# EAGLE design Schematics (EAGLE 6.0)
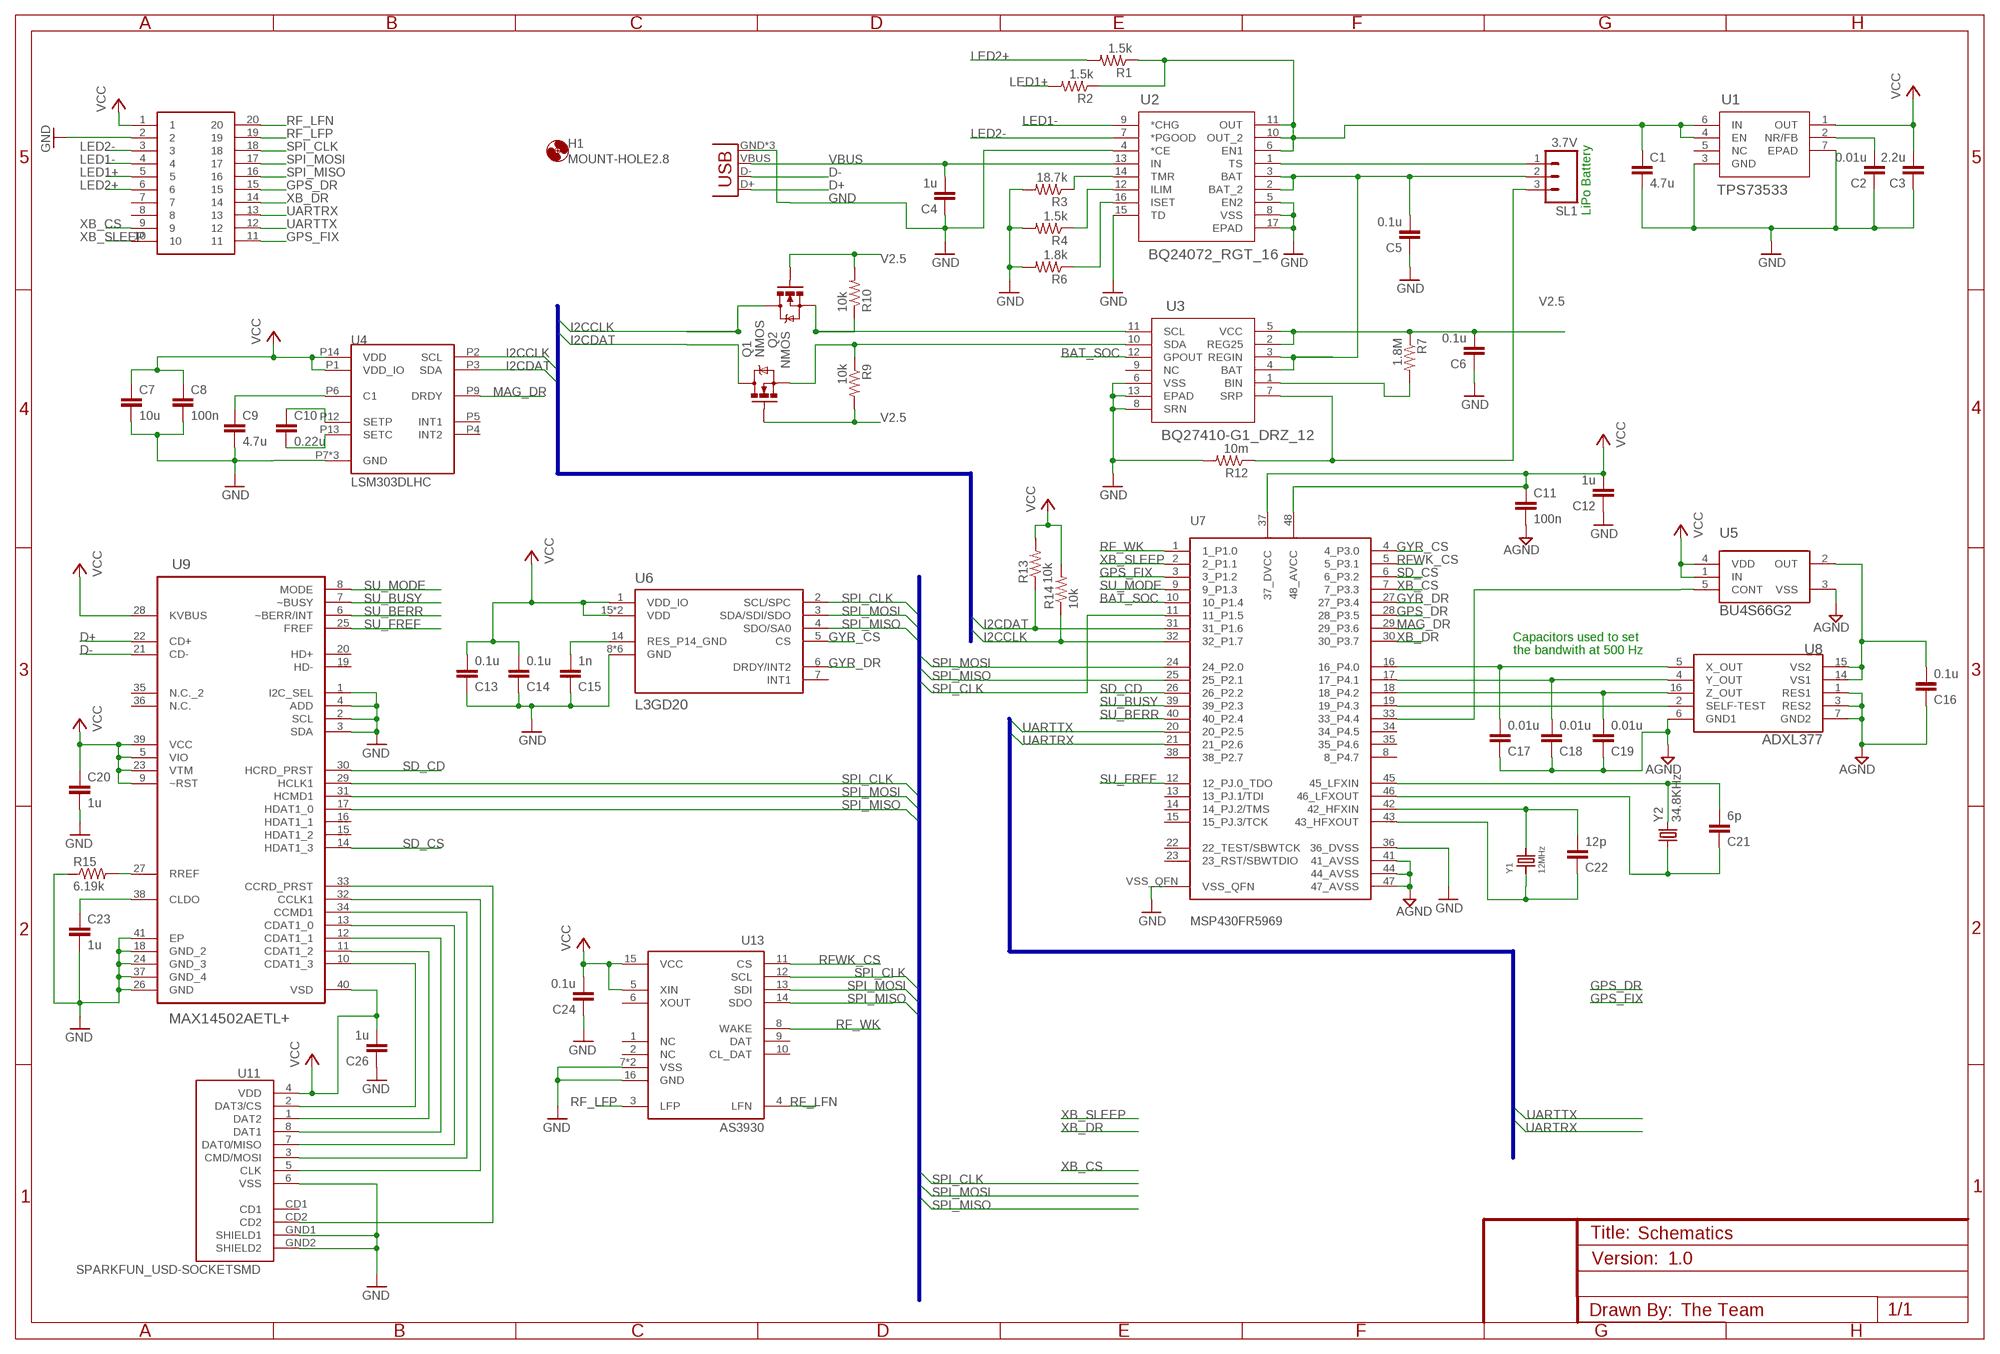
[diagram p0: schematic, sheet 1]

## Parts
C1  4.7u  C-EUC0603  [C0603]
C2  0.01u  C-EUC0603  [C0603]
C3  2.2u  C-EUC0603  [C0603]
C4  1u  C-EUC0603  [C0603]
C5  0.1u  C-EUC0603  [C0603]
C6  0.1u  C-EUC0603  [C0603]
C7  10u  C-EUC0603  [C0603]
C8  100n  C-EUC0603  [C0603]
C9  4.7u  C-EUC0603  [C0603]
C10  0.22u  C-EUC0603  [C0603]
C11  100n  C-EUC0603  [C0603]
C12  1u  C-EUC0603  [C0603]
C13  0.1u  C-EUC0603  [C0603]
C14  0.1u  C-EUC0603  [C0603]
C15  1n  C-EUC0603  [C0603]
C16  0.1u  C-EUC0603  [C0603]
C17  0.01u  C-EUC0603  [C0603]
C18  0.01u  C-EUC0603  [C0603]
C19  0.01u  C-EUC0603  [C0603]
C20  1u  C-EUC0603  [C0603]
C21  6p  C-EUC0603  [C0603]
C22  12p  C-EUC0603  [C0603]
C23  1u  C-EUC0603  [C0603]
C24  0.1u  C-EUC0603  [C0603]
C26  1u  C-EUC0603  [C0603]
H1  MOUNT-HOLE2.8  [2,8]
JP1  USB-MICROB  [USB-MICROB]
Q1  NMOS  MOSFET-NCHANNELBSS138  [SOT23]
Q2  NMOS  MOSFET-NCHANNELBSS138  [SOT23]
R1  1.5k  R-US_R0603  [R0603]
R2  1.5k  R-US_R0603  [R0603]
R3  18.7k  R-US_R0603  [R0603]
R4  1.5k  R-US_R0603  [R0603]
R6  1.8k  R-US_R0603  [R0603]
R7  1.8M  R-US_R0603  [R0603]
R9  10k  R-US_R0603  [R0603]
R10  10k  R-US_R0603  [R0603]
R12  10m  R-US_R0603  [R0603]
R13  10k  R-US_R0603  [R0603]
R14  10k  R-US_R0603  [R0603]
R15  6.19k  R-US_R0603  [R0603]
SL1  3.7V  M03  [03P]
U1  TPS73533  TPS73533_DRV_6  [DRV6_1P6X1]
U2  BQ24072_RGT_16  [RGT16_1P7X1P7]
U3  BQ27410-G1_DRZ_12  [DRZ12_1P95X2P45]
U4  LSM303DLHC  [LGA_3X5X1_14L]
U5  BU4S66G2  [SSOP5]
U6  L3GD20  [L3GD20]
U7  MSP430FR5969  [RGZ(S-PQFP-N48)]
U8  ADXL377  [LFCSP-16]
U9  MAX14502AETL+  [QFN40P500X500X80-41N]
U11  SPARKFUN_USD-SOCKETSMD  [SPARKFUN_MICRO-SD-SOCKET-PP]
U13  AS3930  [AS3930]
U$1  20-SOCKET  [20-SOCKET]
Y1  12MHz  CRYSTAL  [3.2X2.5MM]
Y2  34.8KHz  CRYSTALTC38H  [TC38H]

## Nets
AGND: C11.2 C16.1 C17.1 C18.1 C19.1 U5.3(VSS) U7.41(41_AVSS) U7.44(44_AVSS) U7.47(47_AVSS) U8.1(RES1) U8.3(RES2) U8.6(GND1) U8.7(GND2)
BAT_SOC: U3.12(GPOUT) U7.10(10_P1.4)
D+: JP1.D+ U9.22(CD+)
D-: JP1.D- U9.21(CD-)
GND: C1.2 C2.1 C3.1 C4.1 C5.1 C6.1 C7.2 C8.2 C9.2 C12.1 C13.1 C14.1 C15.1 C20.2 C23.2 C24.1 C26.1 JP1.GND JP1.MT1(GND) JP1.MT2(GND) R3.2 R4.2 R6.2 R12.2 R15.1 U1.3(GND) U1.7(EPAD) U2.4(*CE) U2.5(EN2) U2.8(VSS) U2.15(TD) U2.17(EPAD) U3.6(VSS) U3.8(SRN) U3.13(EPAD) U4.P7(GND) U4.P10(GND) U4.P11(GND) U6.8(GND) U6.9(GND) U6.10(GND) U6.11(GND) U6.12(GND) U6.13(GND) U7.36(36_DVSS) U7.VSS_QFN U9.1(I2C_SEL) U9.2(SCL) U9.3(SDA) U9.4(ADD) U9.18(GND_2) U9.24(GND_3) U9.26(GND) U9.37(GND_4) U9.41(EP) U11.6(VSS) U11.GND1(SHIELD1) U11.GND2(SHIELD2) U13.7(VSS) U13.16(GND) U13.EXP(VSS) U$1.2
GPS_DR: U7.28(28_P3.5) U$1.15
GPS_FIX: U7.3(3_P1.2) U$1.11
GYR_CS: U6.5(CS) U7.4(4_P3.0)
GYR_DR: U6.6(DRDY/INT2) U7.27(27_P3.4)
I2CCLK: Q2.3(D) R14.1 U4.P2(SCL) U7.32(32_P1.7)
I2CDAT: Q1.3(D) R13.1 U4.P3(SDA) U7.31(31_P1.6)
LED1+: R2.2 U$1.5
LED1-: U2.9(*CHG) U$1.4
LED2+: R1.2 U$1.6
LED2-: U2.7(*PGOOD) U$1.3
MAG_DR: U4.P9(DRDY) U7.29(29_P3.6)
N$1: U5.5(CONT) U7.33(33_P4.4)
N$2: C16.2 U5.2(OUT) U8.14(VS1) U8.15(VS2)
N$3: C21.2 U7.45(45_LFXIN) Y2.2
N$4: C21.1 U7.46(46_LFXOUT) Y2.1
N$5: U7.19(19_P4.3) U8.2(SELF-TEST)
N$6: Q1.2(S) R9.1 U3.10(SDA)
N$8: C15.2 U6.14(RES_P14_GND)
N$12: C22.2 U7.42(42_HFXIN) Y1.P$3
N$13: C1.1 R1.1 R2.1 U1.4(EN) U1.6(IN) U2.6(EN1) U2.10(OUT_2) U2.11(OUT)
N$15: C22.1 U7.43(43_HFXOUT) Y1.P$1
N$16: U9.10(CDAT1_3) U11.2(DAT3/CS)
N$17: U9.11(CDAT1_2) U11.1(DAT2)
N$18: C17.2 U7.16(16_P4.0) U8.5(X_OUT)
N$19: U9.12(CDAT1_1) U11.8(DAT1)
N$20: C18.2 U7.17(17_P4.1) U8.4(Y_OUT)
N$21: C19.2 U7.18(18_P4.2) U8.16(Z_OUT)
N$22: R7.2 U3.1(BIN)
N$23: U9.13(CDAT1_0) U11.7(DAT0/MISO)
N$24: Q2.2(S) R10.1 U3.11(SCL)
N$25: C9.1 U4.P6(C1)
N$26: C10.1 U4.P12(SETP)
N$27: C10.2 U4.P13(SETC)
N$28: R6.1 U2.16(ISET)
N$29: R4.1 U2.12(ILIM)
N$30: R3.1 U2.14(TMR)
N$31: C2.2 U1.2(NR/FB)
N$32: U9.34(CCMD1) U11.3(CMD/MOSI)
N$33: R12.1 SL1.3 U3.7(SRP)
N$37: U9.32(CCLK1) U11.5(CLK)
N$39: C5.2 SL1.2 U2.2(BAT_2) U2.3(BAT) U3.3(REGIN) U3.4(BAT)
N$40: SL1.1 U2.1(TS)
N$43: U9.33(CCRD_PRST) U11.CD2
N$46: R15.2 U9.27(RREF)
N$48: C23.1 U9.38(CLDO)
RF_LFN: U13.4(LFN) U$1.20
RF_LFP: U13.3(LFP) U$1.19
RF_WK: U7.1(1_P1.0) U13.8(WAKE)
RFWK_CS: U7.5(5_P3.1) U13.11(CS)
SD_CD: U7.26(26_P2.2) U9.30(HCRD_PRST)
SD_CS: U7.6(6_P3.2) U9.14(HDAT1_3)
SPI_CLK: U6.2(SCL/SPC) U7.11(11_P1.5) U9.29(HCLK1) U13.12(SCL) U$1.18
SPI_MISO: U6.4(SDO/SA0) U7.25(25_P2.1) U9.17(HDAT1_0) U13.14(SDO) U$1.16
SPI_MOSI: U6.3(SDA/SDI/SDO) U7.24(24_P2.0) U9.31(HCMD1) U13.13(SDI) U$1.17
SU_BERR: U7.40(40_P2.4) U9.6(~BERR/INT)
SU_BUSY: U7.39(39_P2.3) U9.7(~BUSY)
SU_FREF: U7.12(12_PJ.0_TDO) U9.25(FREF)
SU_MODE: U7.9(9_P1.3) U9.8(MODE)
UARTRX: U7.21(21_P2.6) U$1.13
UARTTX: U7.20(20_P2.5) U$1.12
V2.5: C6.2 Q1.1(G) Q2.1(G) R7.1 R9.2 R10.2 U3.2(REG25) U3.5(VCC)
VBUS: C4.2 JP1.VBUS U2.13(IN)
VCC: C3.2 C7.1 C8.1 C11.1 C12.2 C13.2 C14.2 C20.1 C24.2 C26.2 R13.2 R14.2 U1.1(OUT) U4.P1(VDD_IO) U4.P14(VDD) U5.1(IN) U5.4(VDD) U6.1(VDD_IO) U6.15(VDD) U6.16(VDD) U7.37(37_DVCC) U7.48(48_AVCC) U9.5(VIO) U9.9(~RST) U9.23(VTM) U9.28(KVBUS) U9.39(VCC) U9.40(VSD) U11.4(VDD) U13.5(XIN) U13.15(VCC) U$1.1
XB_CS: U7.7(7_P3.3) U$1.9
XB_DR: U7.30(30_P3.7) U$1.14
XB_SLEEP: U7.2(2_P1.1) U$1.10
Unconnected: U1.5(NC) U3.9(NC) U4.P4(INT2) U4.P5(INT1) U6.7(INT1) U7.8(8_P4.7) U7.13(13_PJ.1/TDI) U7.14(14_PJ.2/TMS) U7.15(15_PJ.3/TCK) U7.22(22_TEST/SBWTCK) U7.23(23_RST/SBWTDIO) U7.34(34_P4.5) U7.35(35_P4.6) U7.38(38_P2.7) U9.15(HDAT1_2) U9.16(HDAT1_1) U9.19(HD-) U9.20(HD+) U9.35(N.C._2) U9.36(N.C.) U11.CD1 U13.1(NC) U13.2(NC) U13.6(XOUT) U13.9(DAT) U13.10(CL_DAT) U$1.7 U$1.8

## Buses
I2CDAT,I2CCLK
SPI_CLK,SPI_MOSI,SPI_MISO
UARTTX,UARTRX

## Notes on the sheet
- LiPo Battery
- Capacitors used to set
- the bandwith at 500 Hz

## Library data of the parts
C1-C24 C26 = rcl:C-EU: CAPACITOR, European symbol
H1 = holes:MOUNT-HOLE: MOUNTING HOLE with drill center marker
JP1 = SparkFun-Connectors:USB: USB Connectors USB-B-PTH is fully proven SKU : PRT-00139/CONN-08278 USB-miniB is fully proven SKU : PRT-00587 USB-A-PCB is untested. USB-A-H is throughly reviewed, but untested. Spark Fun Electronics SKU : PRT-00437 USB-B-SMT is throughly reviewed, but untested. Needs silkscreen touching up. USB-A-S has not been used/tested USB-MB-H has not been used/tested USB-MICROB has been used. CONN-09505; PROD_ID: CONN-09505
Q1 Q2 = SparkFun-DiscreteSemi:MOSFET-NCHANNEL: Common NMOSFET Parts MFG P/N Store ID Prod ID FDD8780 TRANS-09984 SI7820DN TRANS-11055 FDS6630A IC-08089 2N7002PW TRANS-11151 FQP30N06L COM-10213 TRANS-10060 BSS123LT1G TRANS-08345 BSS138 TRANS-00830 BS170 2N7000; PROD_ID: TRANS-00830
R1-R4 R6 R7 R9 R10 R12-R15 = rcl:R-US_: RESISTOR, American symbol
SL1 = con-amp-quick:M03: AMP QUICK CONNECTOR; OC_FARNELL: unknown; OC_NEWARK: unknown
U1 = Micro2:TPS73533_DRV_6; DATASHEETURL: http://www.ti.com/lit/gpn/TPS73533; DESCRIPTION: Single Output LDO, 500mA, Fixed (3.3V), Low Quiescent Current, Low Noise, High PSRR; FAMILY_NAME: SINGLE CHANNEL LDO; GENERIC_PART_NUMBER: TPS73533; INDUSTRY_STD_PKG_TYPE: SON; MANUFACTURER: Texas Instruments; MANUFACTURER_PART_NUMBER: tps73533_drv_6; PACKAGE_DESIGNATOR: DRV; PIN_COUNT: 6; VENDOR: Texas Instruments
U2 = Micro2:BQ24072_RGT_16; DATASHEETURL: http://www.ti.com/lit/gpn/BQ24072; DESCRIPTION: USB-Friendly Li-Ion Battery Charger and Power-Path Management IC, Vout 200mV above Vbat; FAMILY_NAME: BATTERY CHARGE MANAGEMENT; GENERIC_PART_NUMBER: BQ24072; INDUSTRY_STD_PKG_TYPE: QFN; MANUFACTURER: Texas Instruments; PACKAGE_DESIGNATOR: RGT; PIN_COUNT: 16
U3 = Micro2:BQ27410-G1_DRZ_12; DATASHEETURL: http://www.ti.com/lit/gpn/BQ27410-G1; DESCRIPTION: System-Side Impedance Track Fuel Gauge With Direct Battery Connection; FAMILY_NAME: BATTERY FUEL GAUGE; GENERIC_PART_NUMBER: BQ27410-G1; INDUSTRY_STD_PKG_TYPE: SON; MANUFACTURER: Texas Instruments; PACKAGE_DESIGNATOR: DRZ; PIN_COUNT: 12
U4 = Micro2:LSM303DLHC
U5 = Micro2:BU4S66G2
U6 = Micro2:L3GD20: L3GD20
U7 = hijack:MSP430FR5969
U8 = Micro2:ADXL377
U9 = Micro2:MAX14502AETL+: Hi-Speed USB-to-SD Card Readers with Bypass; MPN: MAX14502AETL+; OC_FARNELL: -; OC_NEWARK: 09R0393; PACKAGE: TQFN-40; SUPPLIER: Maxim
U11 = Micro2:SPARKFUN_USD-SOCKET: microSD Socket Push-push type uSD socket. Schematic element and footprint production proven. Spark Fun Electronics SKU : PRT-00127. tDoc lines correctly indicate media card edge positions when inserting (unlocked, locked, depressed).
U13 = Micro2:AS3930: AS3930
U$1 = Micro2:20-SOCKET
Y1 = Micro2:CRYSTAL
Y2 = SparkFun-FreqCtrl:CRYSTAL: Various standard crystals. Proven footprints. Spark Fun Electronics SKU : COM-00534

## Board
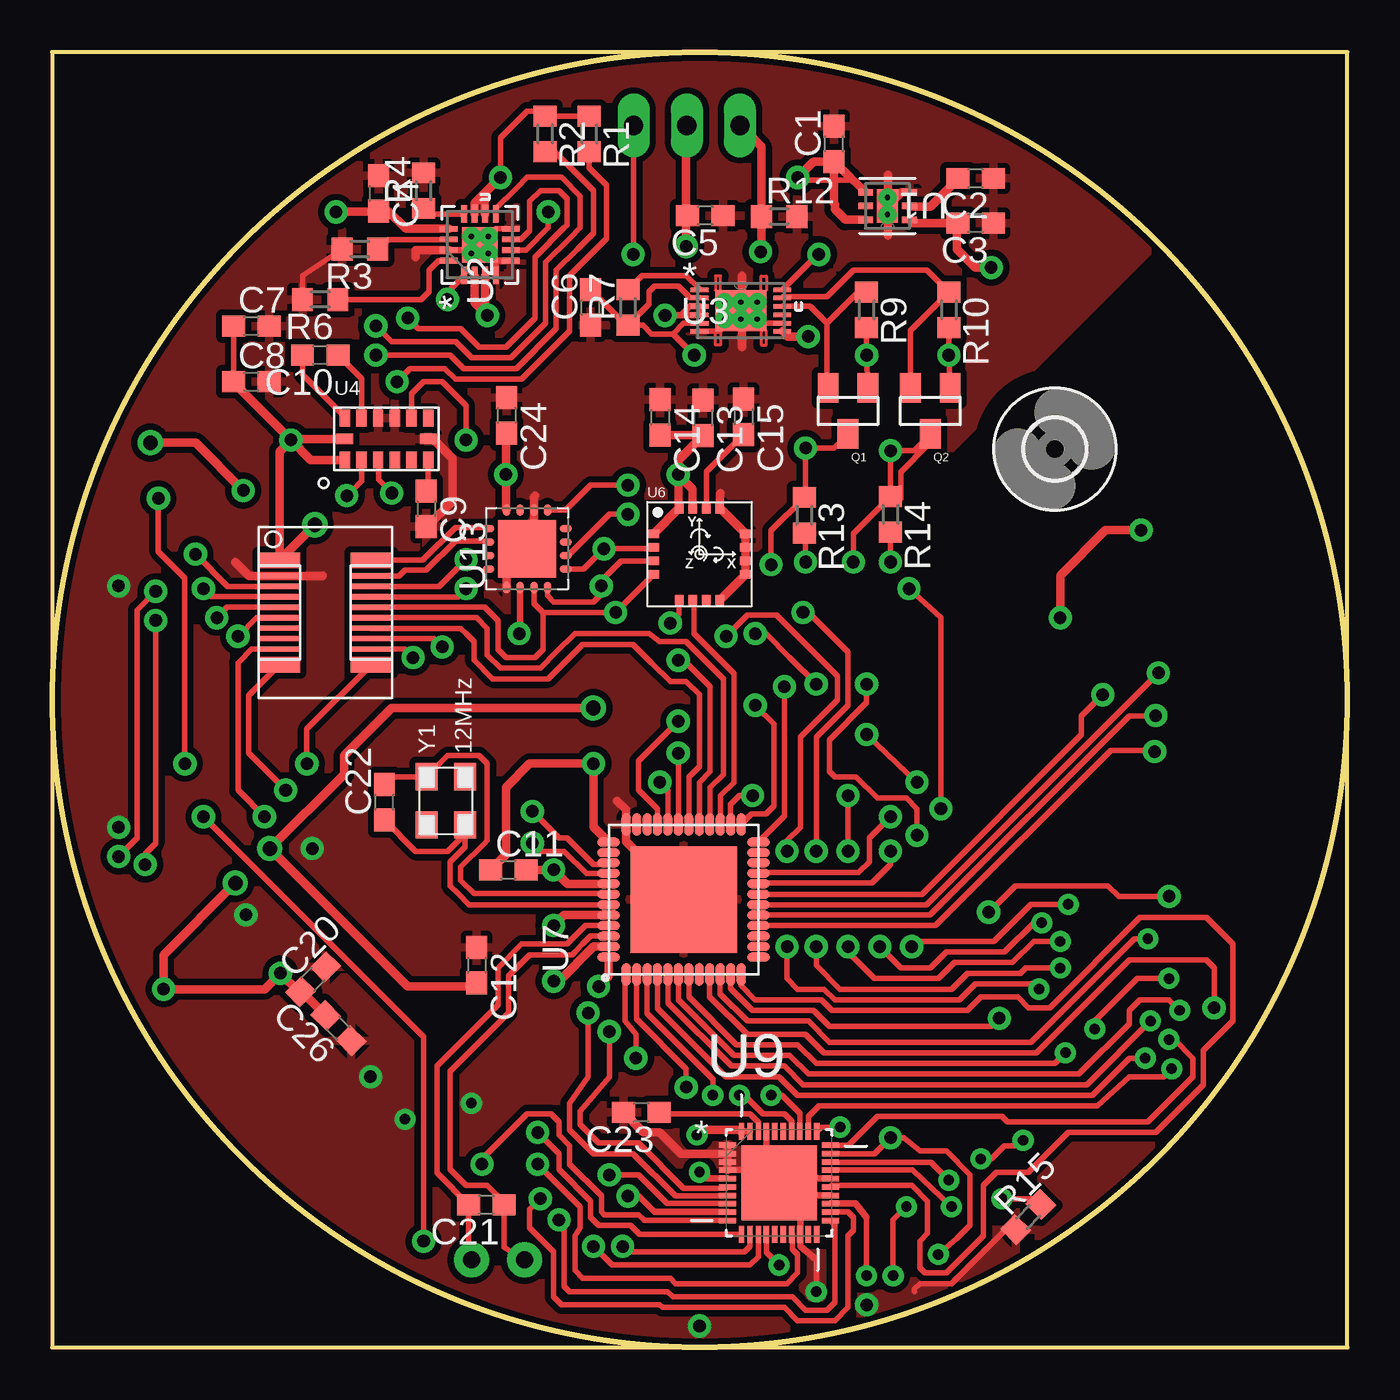
[diagram p1: board, top side]
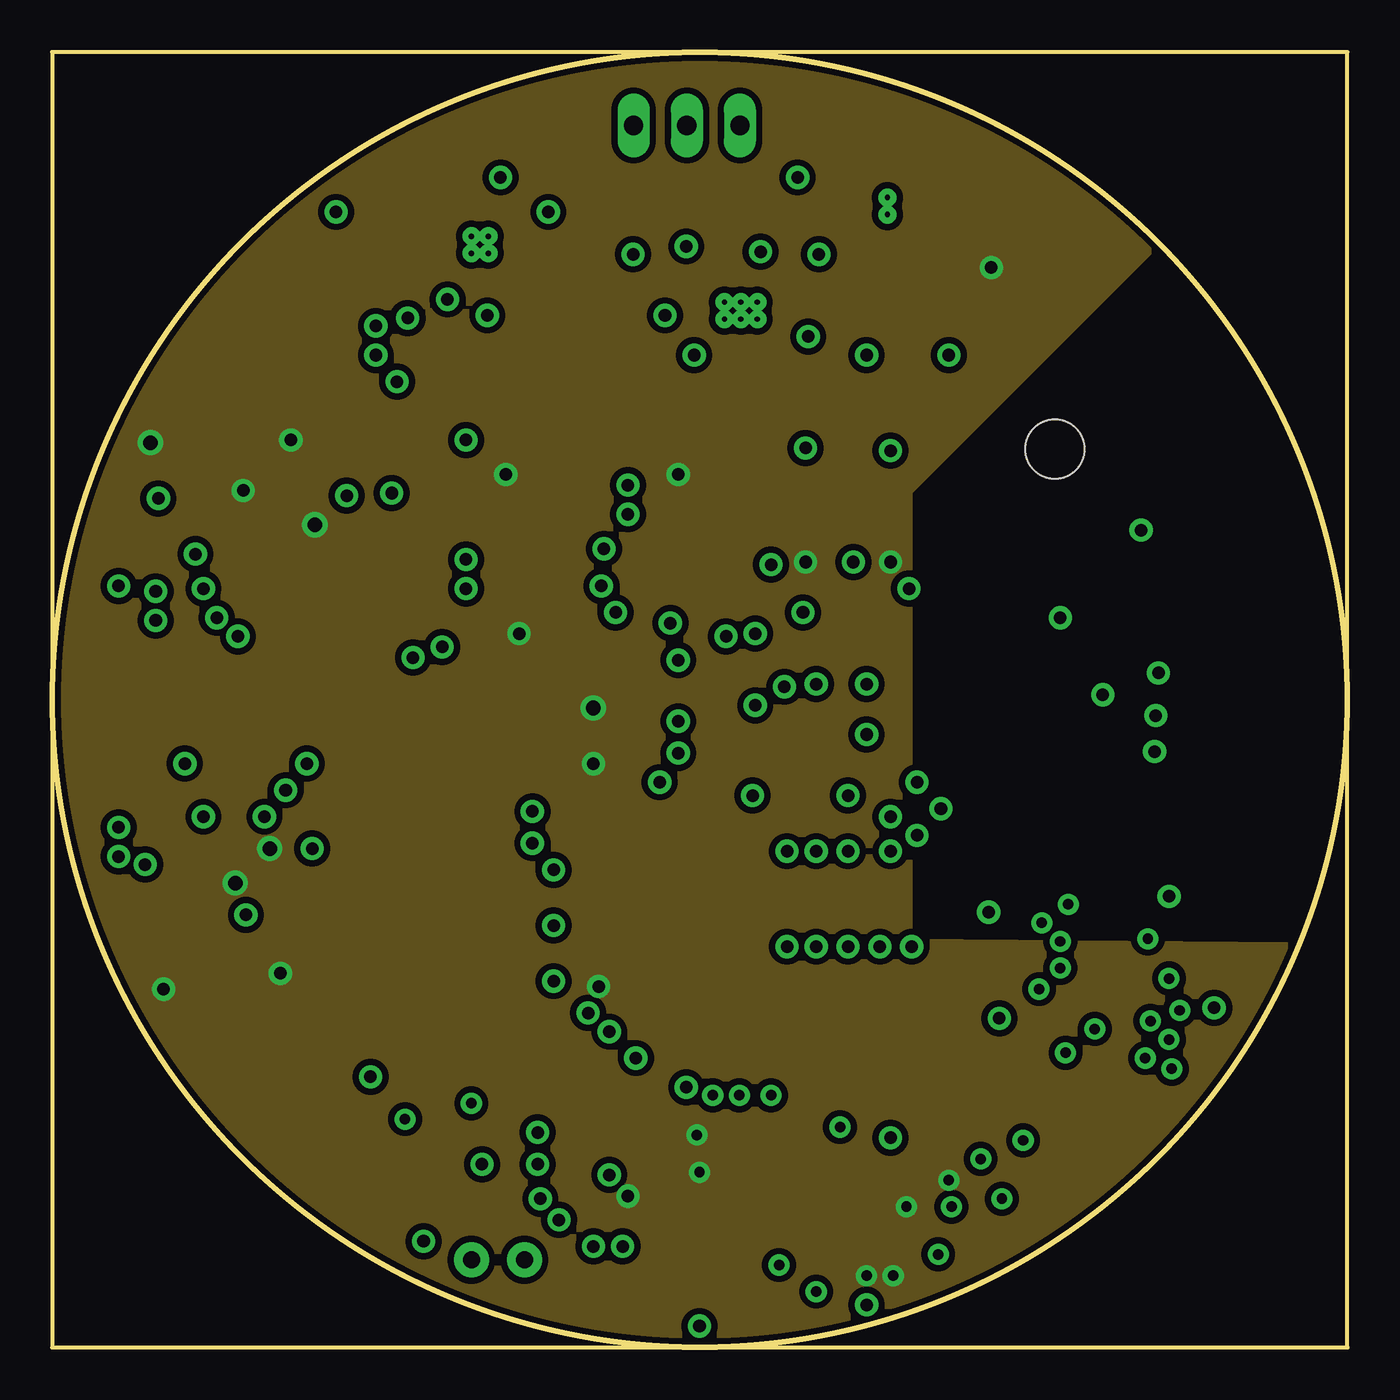
[diagram p2: board, inner layer VCC]
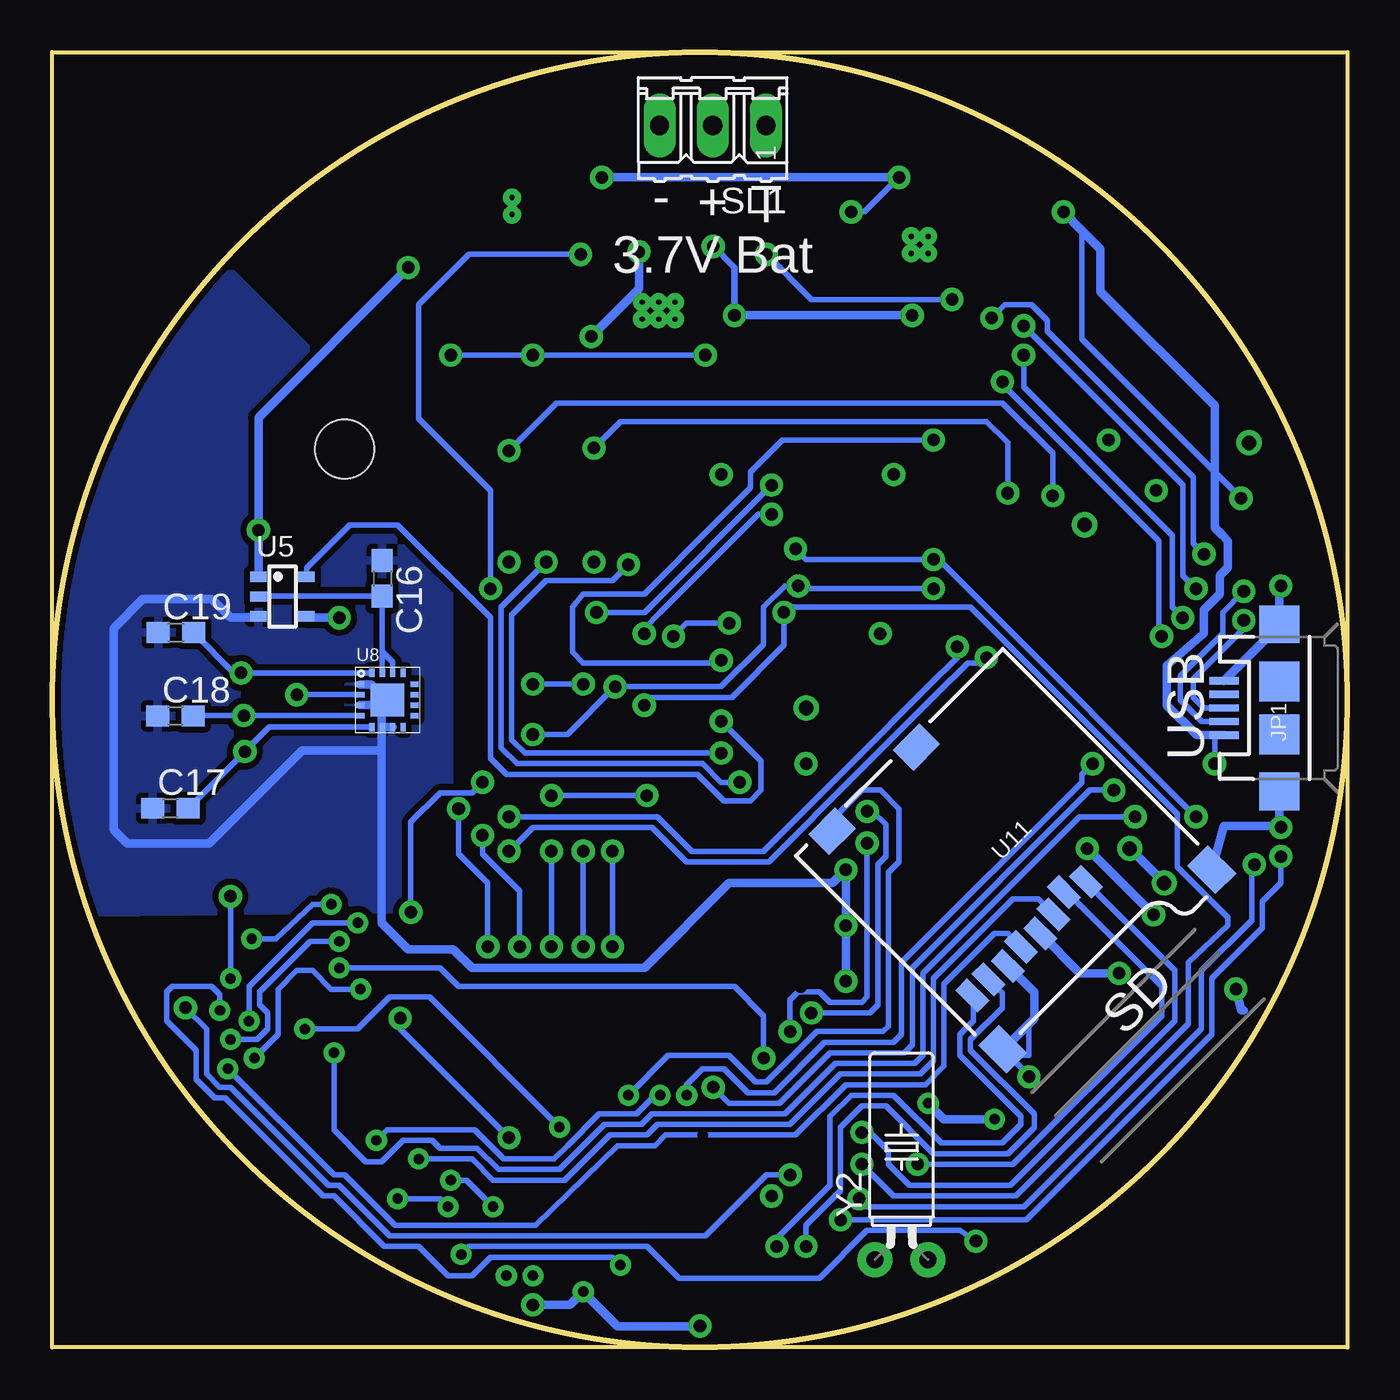
[diagram p3: board, bottom side, seen from below]

Size 62 x 62 mm. Coordinates in mm from the lower left corner, seen from the top.
Outline: 0,0 62,0 62,62 0,62 0,0
Outline: circle at 31,31 radius 31
Copper layers ((1*2)+(15*16)): Top 0.035mm / dielectric 0.62mm / VCC 0.035mm / dielectric 0.62mm / GND 0.035mm / dielectric 0.62mm / Bottom 0.035mm
Design rules: minimum track width 8mil, minimum drill 20mil, track to track 8mil, track to pad 8mil, pad to pad 8mil, via to via 8mil, smd to smd 8mil, copper to edge 10mil, drill to drill 8mil, minimum pad ring 12mil, minimum via ring 10mil, stop-mask expansion 4mil, vias tented up to drill 25mil, thermal gap 10mil

### Footprints (pad centres in the part's own frame; a part is rotated, then mirrored left to right if it is on the bottom)
C0603 = smd 1.1 x 1: 1 -0.85,0; 2 0.85,0
2,8 = hole 2.8: 0,0
USB-MICROB = smd 0.35 x 1.4: D+ 0,2.65; D- -0.65,2.65; GND 1.3,2.65; ID 0.65,2.65; VBUS -1.3,2.65 | smd 1.8 x 1.9: MT1 -4,0; MT2 4,0 | smd 1.9 x 1.9: P$1 -1.27,0; P$2 1.27,0
SOT23 = smd 1 x 1.4: 1 -0.95,-1.1; 2 0.95,-1.1; 3 0,1.1
R0603 = smd 1 x 1.1: 1 -0.85,0; 2 0.85,0
03P = drill 0.914 long: 1 -2.54,0; 2 0,0; 3 2.54,0
DRV6_1P6X1 = smd 0.711 x 0.305: 1 -1.041,0.66; 2 -1.041,0; 3 -1.041,-0.66; 4 1.041,-0.66; 5 1.041,0; 6 1.041,0.66 | smd 1.016 x 1.6: 7 0,0 | drill 0.254: V 0,-0.406; V_2 0,0.406
RGT16_1P7X1P7 = smd 0.838 x 0.279: 1 -1.473,0.762; 2 -1.473,0.254; 3 -1.473,-0.254; 4 -1.473,-0.762; 9 1.473,-0.762; 10 1.473,-0.254; 11 1.473,0.254; 12 1.473,0.762 | smd 0.279 x 0.838: 5 -0.762,-1.473; 6 -0.254,-1.473; 7 0.254,-1.473; 8 0.762,-1.473; 13 0.762,1.473; 14 0.254,1.473; 15 -0.254,1.473; 16 -0.762,1.473 | smd 1.702 x 1.702: 17 0,0 | drill 0.254: V 0.406,0.406; V_2 -0.406,0.406; V_3 -0.406,-0.406; V_4 0.406,-0.406
DRZ12_1P95X2P45 = smd 0.838 x 0.203: 1 -1.981,0.991; 2 -1.981,0.61; 3 -1.981,0.203; 4 -1.981,-0.203; 5 -1.981,-0.61; 6 -1.981,-0.991; 7 1.981,-0.991; 8 1.981,-0.61; 9 1.981,-0.203; 10 1.981,0.203; 11 1.981,0.61; 12 1.981,0.991 | smd 2.438 x 1.956: 13 0,0 | drill 0.254: V 0.787,0.406; V_2 -0.787,0.406; V_3 -0.787,-0.406; V_4 0,-0.406; V_5 0,0.406; V_6 0.787,-0.406
LGA_3X5X1_14L = smd 0.5 x 0.8: P1 -2,-1; P2 -1.2,-1; P3 -0.4,-1; P4 0.4,-1; P5 1.2,-1; P6 2,-1; P8 2,1; P9 1.2,1; P10 0.4,1; P11 -0.4,1; P12 -1.2,1; P13 -2,1 | smd 0.8 x 0.5: P7 2,0; P14 -2,0
SSOP5 = smd 0.8 x 0.5: 1 -1.15,0.95; 2 -1.143,0; 3 -1.15,-0.95; 4 1.15,-0.95; 5 1.15,0.95
L3GD20 = smd 0.5 x 0.4: 1 -2.2,0.975; 2 -2.2,0.325; 3 -2.2,-0.325; 4 -2.2,-0.975; 9 2.2,-0.975; 10 2.2,-0.325; 11 2.2,0.325; 12 2.2,0.975 | smd 0.4 x 0.5: 5 -0.975,-2.2; 6 -0.325,-2.2; 7 0.325,-2.2; 8 0.975,-2.2; 13 0.975,2.2; 14 0.325,2.2; 15 -0.325,2.2; 16 -0.975,2.2
RGZ(S-PQFP-N48) = smd 1.075 x 0.42: 1 -3.587,2.75; 2 -3.587,2.25; 3 -3.587,1.75; 4 -3.587,1.25; 5 -3.587,0.75; 6 -3.587,0.25; 7 -3.587,-0.25; 8 -3.587,-0.75; 9 -3.587,-1.25; 10 -3.587,-1.75; 11 -3.587,-2.25; 12 -3.587,-2.75; 25 3.587,-2.75; 26 3.587,-2.25; 27 3.587,-1.75; 28 3.587,-1.25; 29 3.587,-0.75; 30 3.587,-0.25; 31 3.587,0.25; 32 3.587,0.75; 33 3.587,1.25; 34 3.587,1.75; 35 3.587,2.25; 36 3.587,2.75 | smd 0.42 x 1.075: 13 -2.75,-3.587; 14 -2.25,-3.587; 15 -1.75,-3.587; 16 -1.25,-3.587; 17 -0.75,-3.587; 18 -0.25,-3.587; 19 0.25,-3.587; 20 0.75,-3.587; 21 1.25,-3.587; 22 1.75,-3.587; 23 2.25,-3.587; 24 2.75,-3.587; 37 2.75,3.587; 38 2.25,3.587; 39 1.75,3.587; 40 1.25,3.587; 41 0.75,3.587; 42 0.25,3.587; 43 -0.25,3.587; 44 -0.75,3.587; 45 -1.25,3.587; 46 -1.75,3.587; 47 -2.25,3.587; 48 -2.75,3.587 | smd 5.1 x 5.1: VSS_QFN 0,0
LFCSP-16 = smd 0.4 x 0.25: 1 -1.3,0.75; 2 -1.3,0.25; 3 -1.3,-0.25; 4 -1.3,-0.75; 9 1.3,-0.75; 10 1.3,-0.25; 11 1.3,0.25; 12 1.3,0.75 | smd 0.25 x 0.4: 5 -0.75,-1.3; 6 -0.25,-1.3; 7 0.25,-1.3; 8 0.75,-1.3; 13 0.75,1.3; 14 0.25,1.3; 15 -0.25,1.3; 16 -0.75,1.3 | smd 1.6 x 1.6: NC 0,0
QFN40P500X500X80-41N = smd 0.813 x 0.254: 1 -2.464,1.803; 2 -2.464,1.397; 3 -2.464,0.991; 4 -2.464,0.61; 5 -2.464,0.203; 6 -2.464,-0.203; 7 -2.464,-0.61; 8 -2.464,-0.991; 9 -2.464,-1.397; 10 -2.464,-1.803; 21 2.464,-1.803; 22 2.464,-1.397; 23 2.464,-0.991; 24 2.464,-0.61; 25 2.464,-0.203; 26 2.464,0.203; 27 2.464,0.61; 28 2.464,0.991; 29 2.464,1.397; 30 2.464,1.803 | smd 0.254 x 0.813: 11 -1.803,-2.464; 12 -1.397,-2.464; 13 -0.991,-2.464; 14 -0.61,-2.464; 15 -0.203,-2.464; 16 0.203,-2.464; 17 0.61,-2.464; 18 0.991,-2.464; 19 1.397,-2.464; 20 1.803,-2.464; 31 1.803,2.464; 32 1.397,2.464; 33 0.991,2.464; 34 0.61,2.464; 35 0.203,2.464; 36 -0.203,2.464; 37 -0.61,2.464; 38 -0.991,2.464; 39 -1.397,2.464; 40 -1.803,2.464 | smd 3.607 x 3.607: 41 0,0
SPARKFUN_MICRO-SD-SOCKET-PP = smd 0.8 x 1.5: 1 -8.94,10.7; 2 -7.84,10.3; 3 -6.74,10.7; 4 -5.64,10.9; 5 -4.54,10.7; 6 -3.44,10.9; 7 -2.34,10.7; 8 -1.24,10.7 | smd 1.8 x 1.4: CD1 -7.75,0.4; CD2 -2.05,0.4 | smd 1.4 x 1.9: GND1 -13.6,14.55; GND2 -0.45,13.55
AS3930 = smd 0.35 x 0.55: 1 -0.975,1.85; 2 -0.325,1.85; 3 0.325,1.85; 4 0.975,1.85; 9 0.975,-1.85; 10 0.325,-1.85; 11 -0.325,-1.85; 12 -0.975,-1.85 | smd 0.55 x 0.35: 5 1.85,0.975; 6 1.85,0.325; 7 1.85,-0.325; 8 1.85,-0.975; 13 -1.85,-0.975; 14 -1.85,-0.325; 15 -1.85,0.325; 16 -1.85,0.975 | smd 2.76 x 2.76: EXP 0,0
20-SOCKET = smd 0.75 x 2: 1 2.5,2.2; 10 -2.5,2.2; 11 -2.5,-2.2; 20 2.5,-2.2 | smd 0.25 x 2: 2 1.75,2.2; 3 1.25,2.2; 4 0.75,2.2; 5 0.25,2.2; 6 -0.25,2.2; 7 -0.75,2.2; 8 -1.25,2.2; 9 -1.75,2.2; 12 -1.75,-2.2; 13 -1.25,-2.2; 14 -0.75,-2.2; 15 -0.25,-2.2; 16 0.25,-2.2; 17 0.75,-2.2; 18 1.25,-2.2; 19 1.75,-2.2
3.2X2.5MM = smd 1.3 x 1.05: P$1 -1.15,-0.925; P$2 1.15,-0.925; P$3 1.15,0.925; P$4 -1.15,0.925
TC38H = drill 0.813 pad 1.676: 1 -1.27,0; 2 1.27,0

### Placement (x,y rotation side)
C1  37.43,57.61 90 top
C2  44.21,55.96 180 top
C3  44.2,53.82 180 top
C4  15.62,55.24 270 top
C5  31.27,54.18 180 top
C6  25.78,49.78 90 top
C7  9.53,48.9 0 top
C8  9.53,46.23 0 top
C9  17.91,40.13 270 top
C10  12.83,47.5 180 top
C11  21.84,22.86 0 top
C12  20.32,18.29 270 top
C13  31.15,44.5 270 top
C14  29.1,44.51 270 top
C15  33.09,44.55 270 top
C16  46.2,36.8 270 bottom
C17  56.34,25.81 0 bottom
C18  56.11,30.23 0 bottom
C19  56.08,34.21 0 bottom
C20  12.48,17.62 45 top
C21  20.78,6.83 180 top
C22  15.9,26.09 90 top
C23  28.2,11.25 180 top
C24  21.75,44.62 270 top
C26  13.7,15.28 135 top
H1  48,43 0 top
JP1  3.25,30.61 90 bottom
Q1  38.1,44.83 180 top
Q2  42.04,44.83 180 top
R1  25.7,58.09 270 top
R2  23.6,58.09 270 top
R3  14.73,52.58 180 top
R4  17.78,55.37 90 top
R6  12.83,50.16 180 top
R7  27.56,49.78 90 top
R9  38.99,49.66 270 top
R10  42.93,49.66 270 top
R12  34.8,54.13 0 top
R13  36.01,39.84 270 top
R14  40.13,39.88 270 top
R15  46.73,6.23 45 top
SL1  30.38,58.5 180 bottom
U1  39.99,54.64 180 top
U2  20.47,52.78 90 top
U3  32.97,49.63 0 top
U4  16,43.48 0 top
U5  50.98,35.94 0 bottom
U6  30.99,37.97 0 top
U7  30.23,21.44 90 top
U8  45.95,30.99 0 bottom
U9  34.8,7.87 0 top
U11  26.39,23.53 225 bottom
U13  22.73,38.23 90 top
U$1  13.08,35.18 90 top
Y1  18.85,26.16 90 top
Y2  21.34,4.19 0 bottom

### Tracks (layer width: path | path; a pad name or v marks a point on that pad's centre or on a via)
AGND  (via drill 0.6)
  Top 0.406: U7.41 24.68,22.19 v24,22.86 | v24,20.19 24.5,20.69 U7.44 26.67,20.69 26.67,20.7 | 23.91,22.77 v24,22.86 | C11.2 v24,22.86 | U7.47 25.92,19.19 24.26,17.53 v24,17.53
  Bottom 0.406: 46.23,28.57 46.23,20.32 44.96,19.05 42.8,19.05 41.91,18.16 33.66,18.16 29.59,22.23 24.64,22.23 v24,22.86 v24,20.19 | 46.23,28.57 46.23,29.66 | 46.23,29.66 U8.6 | v24,20.19 24,19.81 | U8.7 46.23,29.69 | 46.23,29.69 46.23,29.66 | 53.53,34.99 53.59,35.05 | U8.1 46.72,31.74 46.23,31.24 46.23,30.73 | 46.23,30.73 46.23,29.69 | 46.23,28.57 50.04,28.57 54.48,24.13 58.42,24.13 59.05,24.77 59.05,34.42 57.66,35.81 54.36,35.81 53.47,34.92 52.07,34.92 | U8.3 46.23,30.74 46.23,30.73 | v24,17.53 v24,20.19
  pour Bottom (isolate 0.305): 62,52 54,52 43,41 43,21 62,20.8
BAT_SOC  (via drill 0.5, 0.6)
  Top 0.254: U3.12 36.65,52.32 v36.7,52.32 | v41.02,36.32 42.55,34.92 v42.55,25.78 | U7.10 31.98,16.92 33.27,15.62 36.2,15.62 37.21,14.61 39.12,14.61 46.1,14.61 46.86,14.61 51.82,19.56 v52.45,19.56 | v41.15,19.18 41.4,19.43 44.83,19.43 45.09,19.43 46.86,21.21 47.75,21.21 v48.64,21.21
  Bottom 0.254: v36.7,52.32 42.04,52.32 44.45,49.91 44.45,44.45 41.02,41.02 v41.02,36.32 | v42.55,25.78 42.55,25.4 42.55,23.62 41.15,22.23 v41.15,19.18 | v52.45,19.56 51.31,19.56 49.53,21.21 v48.64,21.21
D+  (via drill 0.6)
  Top 0.254: v4.95,34.8 4.95,24.13 4.45,23.62 v4.45,23.11 | v23.37,7.11 22.86,6.6 22.86,5.71 24,4.57 24,2.41 24.38,2.03 29.08,2.03 29.21,1.91 35.05,1.91 35.69,1.27 37.47,1.27 38.1,1.91 38.1,5.33 38.35,5.59 38.35,6.22 38.1,6.48 U9.22 37.21,6.48
  Bottom 0.254: JP1.D+ 6.86,30.61 7.37,31.11 7.37,32 4.95,34.42 v4.95,34.8 | v4.45,23.11 4.57,22.99 4.57,20.45 6.99,18.03 6.99,15.24 15.49,6.73 22.99,6.73 v23.37,7.11
D-  (via drill 0.6)
  Top 0.254: v4.95,36.2 4.06,35.31 4.06,24.38 v3.17,23.5 | v24.26,6.1 24.51,5.97 24.51,2.92 24.77,2.67 29.46,2.67 29.72,2.41 35.43,2.41 36.07,1.78 37.08,1.78 37.47,2.16 37.47,5.87 U9.21
  Bottom 0.254: JP1.D- 6.97,29.96 8,30.99 8,32.13 5.97,34.16 5.97,35.18 v4.95,36.2 | v3.17,23.5 3.17,22.23 4.06,21.34 4.06,20.07 6.48,17.65 6.48,14.99 15.37,6.1 v24.26,6.1
GND  (via drill 0.5, 0.6)
  Top 0.254: v15.24,12.95 15.11,12.95 | R3.2 11.98,51.31 R6.2 | U3.6 31.98,48.64 U3.13 33.58,49.02 | U3.8 33.58,49.02 | 33.58,49.02 33.02,49.02 | 36.58,4.19 v36.58,2.67 | v30.99,1.02 30.86,1.02 | R15.1 45.64,5.63 43.05,3.05 41.53,3.05 41.27,2.79 41.27,2.67 | U2.8 21.23,53.54 U2.17 | C9.2 17.91,39.24
  Top 0.305: U9.4 34.19,8.48 U9.37 | U9.26 35,8.08 | U9.24 35.41,7.26 | U2.15 20.22,52.53 U2.17 21.23,52.02 | U2.5 21.23,52.02 | U2.4 21.23,52.02 | 35.79,6.88 35.81,6.86 35.81,5.38 | 36.58,4.19 35.81,4.83 35.81,5.38 | 35.81,5.38 U9.18 | U9.1 32.36,9.65 32.38,9.65
  Top 0.406: v3.17,36.45 3.05,36.45 | v3.17,24.89 3.05,24.89 | 34.19,8.48 U9.41 | 35,8.08 U9.41 | 35.41,7.26 U9.41 | 35.79,6.88 U9.41 | U6.8 U6.9 U6.10 U6.11 U6.12 U6.13 31.96,40.85 32,40.89 | U13.16 21.76,37.25 U13.EXP 23.06,38.55 U13.7 23.06,40.71 23.11,40.77 | 33.02,51.31 33.02,49.02 33.02,47.88 | U1.3 40.65,55.3 U1.7 | 40.01,56.13 40.01,53.21 | 12.95,36.96 12.95,36.93 U$1.2 9.43,36.93 8.76,37.59 | U4.P7 18.24,43.48 19.18,42.55 19.18,40.51 17.91,39.24 | U2.15 17.4,52.53 17.4,52.2 | U9.1 U9.2 | U9.2 U9.4 | 27.05,26.16 27.48,25.74 U7.36 27.48,24.21 30.23,21.46 U7.VSS_QFN | C23.2 28.31,10.29 29.08,10.29 30.1,9.27 32.26,9.27 U9.2
  Bottom 0.254: v15.24,12.95 15.24,13.02 U11.GND2 16.51,13.97 15.24,13.97 15.24,15.24 15.37,15.37
  Bottom 0.406: v3.17,36.45 3.25,36.37 JP1.MT2 3.25,34.56 JP1.GND | JP1.MT1 3.25,24.97 | 3.25,24.97 v3.17,24.89 | 3.25,24.97 5.92,24.97 U11.GND1 | U11.6 14.99,16.99 14.99,15.75 15.37,15.37 16.51,14.22 | v16.89,10.92 19.3,10.92 v20.07,11.68 | v9.27,20.7 v12.45,23.88 | v30.99,1.02 34.92,1.02 v36.58,2.67 37.21,2.03 v38.99,2.03
  pour Top (isolate 0.305): 31,0 arc-90 0,31 arc-90 31,62 44,62 53,53 41,41 41,19.35 62.02,19.16 44,0
GPS_DR
  Top 0.254: U7.28 31.5,25.3 31.5,26.8 32.13,27.43 32.13,32 30.35,33.78 29.84,33.78 29.08,33.78 28.57,34.16 25.02,34.16 24.13,33.27 23.37,32.51 21.46,32.51 20.83,33.15 20.83,34.42 20.32,34.93 U$1.15
GPS_FIX  (via drill 0.5, 0.6)
  Top 0.254: 15.24,32.64 U$1.11 12.19,29.59 v12.19,27.94 | U7.3 28.48,16.1 28.48,15.97 31.62,12.83 v31.62,12.06
  Bottom 0.254: v31.62,12.06 31.62,12.57 30.86,13.34 29.84,13.34 28.7,12.19 27.43,12.19 25.02,14.61 23.75,14.61 21.72,14.61 21.34,14.99 21.34,18.41 12.7,27.05 12.7,27.43 v12.19,27.94
GYR_CS  (via drill 0.5, 0.6)
  Top 0.254: U6.5 30.01,35.09 v29.59,34.67 | v32.26,34.04 33.27,35.05 34.67,35.05 37.59,32.13 37.59,30.99 37.34,30.73 35.81,29.21 35.81,24.89 35.18,24.26 v35.18,23.75 | U7.4 28.98,16.24 32.26,12.95 34.67,12.95 34.8,12.95 35.69,12.06 39.12,12.06 39.24,12.06 49.78,12.06 51.56,13.84 v52.32,13.84 | v35.18,19.18 35.18,17.65 35.69,17.14 | 35.69,17.14 36.96,17.14 | 36.96,17.14 37.47,16.64 | 35.69,17.14 36.96,17.14 | 36.96,17.14 37.47,16.64 | 37.47,16.64 43.43,16.64 44.2,17.4 46.86,17.4 47.12,17.14 v47.24,17.14
  Bottom 0.254: v29.59,34.67 31.62,34.67 v32.26,34.04 | v35.18,23.75 v35.18,19.18 | v52.32,13.84 51.56,14.61 51.18,14.99 51.18,17.14 50.29,18.03 49.78,18.03 49.53,18.03 48.64,17.14 v47.24,17.14
GYR_DR
  Top 0.254: U6.6 30.73,35.7 30.73,34.16 32.64,32.26 32.64,27.05 32,26.42 32,25.02 U7.27
I2CCLK  (via drill 0.6)
  Top 0.254: 41.78,43.43 42.04,43.69 41.27,42.93 v40.13,42.93 R14.1 | U4.P2 14.8,41.47 v14.1,40.77 | U7.32 29.48,26.66 v29.08,27.05 | v38.35,37.59 38.35,38.95 R14.1 | Q2.3 41.91,43.18 40.64,41.91 40.64,40.64 R14.1
  Bottom 0.254: v14.1,40.77 14.1,42.8 16.51,45.21 37.85,45.21 v40.13,42.93 | v29.08,27.05 29.97,27.05 30.86,27.94 39.75,27.94 40.51,28.7 40.51,31.62 40.51,35.43 v38.35,37.59
I2CDAT  (via drill 0.6)
  Top 0.254: U4.P3 15.62,42.48 15.62,41.53 v16.26,40.89 | Q1.3 37.42,43.05 v36.07,43.05 36.07,40.75 R13.1 34.42,39.1 v34.42,37.47 | v29.97,28.45 29.97,25.79 U7.31
  Bottom 0.254: v16.26,40.89 16.26,43.31 17.27,44.32 34.8,44.32 v36.07,43.05 | v34.42,37.47 35.18,36.7 36.32,36.7 36.96,36.7 38.35,36.7 40.01,35.05 40.01,31.75 40.01,29.08 39.37,28.45 v29.97,28.45
LED1+  (via drill 0.6)
  Top 0.254: R2.2 23.66,57.49 23.66,57.24 24.04,57.24 25.91,55.37 25.91,53.34 25.15,52.58 24.13,51.56 24.13,48.77 22.23,46.86 19.68,46.86 19.05,47.5 v15.49,47.5 | v7.87,34.92 8.38,35.43 U$1.5
  Bottom 0.254: v15.49,47.5 15.49,45.97 11.18,41.66 8.38,38.86 8.38,35.43 v7.87,34.92
LED1-  (via drill 0.6)
  Top 0.254: U2.9 21.23,54.51 22.23,55.5 22.73,56.01 24.38,56.01 25.27,55.12 25.27,53.59 24.77,53.09 23.62,51.94 23.62,49.02 21.97,47.37 20.07,47.37 19.3,48.13 16.26,48.13 v15.49,48.9 | v7.24,36.32 7.62,35.94 10.92,35.94 10.89,35.94 U$1.4
  Bottom 0.254: v15.49,48.9 10.03,43.43 7.87,41.27 7.87,36.96 v7.24,36.32
LED2+  (via drill 0.6)
  Top 0.254: R1.2 25.7,56.46 26.54,55.63 26.54,53.09 24.77,51.31 24.77,48.64 22.48,46.35 19.3,46.35 18.8,46.86 17.14,46.86 v16.51,46.23 | v8.89,34.04 9.78,34.93 U$1.6
  Bottom 0.254: v16.51,46.23 16.51,46.1 9.02,38.61 9.02,34.16 v8.89,34.04
LED2-  (via drill 0.6)
  Top 0.254: U2.7 22.43,53.03 22.86,53.47 22.86,54.86 23.37,55.37 24.26,55.37 24.64,54.99 24.64,53.72 24.51,53.59 23.11,52.2 23.11,49.28 21.72,47.88 20.45,47.88 19.56,48.77 17.53,48.77 v17.02,49.28 | v6.86,37.97 8.4,36.43 U$1.3
  Bottom 0.254: v17.02,49.28 16.38,49.91 15.11,49.91 14.35,49.15 14.35,48.64 9.65,43.94 7.37,41.66 7.37,38.48 v6.86,37.97
MAG_DR  (via drill 0.6)
  Top 0.254: U7.29 30.99,26.05 30.99,27.05 31.5,27.56 31.5,31.62 30.23,32.89 v29.97,32.89 | v19.81,43.43 19.81,45.09 18.67,46.23 17.78,46.23 17.2,45.65 U4.P9
  Bottom 0.254: v19.81,43.43 25.53,43.43 27.05,43.43 28.57,41.91 28.57,41.15 30.23,39.5 33.66,36.07 34.92,36.07 35.05,36.07 36.58,36.07 37.08,35.43 37.08,33.27 36.58,32.77 30.1,32.77 v29.97,32.89
N$1  (via drill 0.6)
  Top 0.254: U7.33 28.98,25.76 28.07,26.67 28.07,28.07 v29.97,29.97
  Bottom 0.254: U5.5 49.83,37.29 47.75,39.37 45.47,39.37 41.02,34.92 41.02,28.19 40.26,27.43 31.11,27.43 29.84,26.16 28.57,26.16 28.07,26.67 28.07,28.07 v29.97,29.97
N$2
  Bottom 0.254: 46.2,33.3 46.2,36.13 C16.2 52.11,35.95 U5.2 | 46.2,33.3 U8.15 | U8.14 45.7,32.8 46.2,33.3
N$3
  Top 0.254: U7.45 25.52,20.19 | Y2.2 19.68,4.45 19.93,4.69 C21.2 18.41,8.34 18.41,13.46 20.7,15.75 21.34,16.38 21.34,18.16 22.48,19.3 24.64,19.3 24.77,19.43 25.52,20.19 | 25.52,20.19 25.53,20.19 25.52,20.19
N$4
  Top 0.254: U7.46 25.78,19.68 25.4,19.3 25.02,18.92 24.89,18.8 22.86,18.8 21.84,17.78 21.84,16 21.08,15.24 19.05,13.21 19.05,8.51 19.81,7.75 20.83,7.75 21.72,6.86 21.68,6.83 C21.1 21.63,4.78 Y2.1
N$5  (via drill 0.6)
  Top 0.254: U7.19 40.74,21.69 41.63,21.69 49.28,29.34 49.28,30.23 v50.29,31.24
  Bottom 0.254: v50.29,31.24 U8.2
N$6
  Top 0.254: U3.10 36.27,49.84 37.08,49.02 | 37.08,49.02 37.08,46 Q1.2 | R9.1 38.57,50.51 37.08,49.02
N$8
  Top 0.254: C15.2 31.31,41.92 U6.14
N$12
  Top 0.254: C22.2 16.41,27.31 Y1.P$3 18.93,28.32 20.45,28.32 20.83,27.94 20.83,24.26 20.7,24.13 19.56,22.99 19.56,22.35 20.19,21.72 26.67,21.72 26.64,21.72 U7.42
N$13  (via drill 0.6)
  Top 0.254: R1.1 R2.1 23.62,58.97 23.62,59.18 22.73,59.18 21.46,57.91 v21.46,56.01 21.59,55.88 | U2.6 22.68,52.53 23.75,53.59 v23.75,54.36 | v35.69,56.01 35.56,55.88 38.1,55.88 38.22,56
  Top 0.406: U1.4 38.22,56 C1.1 37.43,54.77 37.47,54.74 37.47,54.48 37.97,53.98 U1.6 | U2.10 20.7,54.28 20.7,55.24 | 20.7,55.24 v21.46,56.01 | v35.69,56.01 36.45,56.77 37.34,56.77 | U2.11 20.22,54.76 20.7,55.24
  Bottom 0.254: v23.75,54.36 23.11,54.36 v21.46,56.01
  Bottom 0.406: v21.46,56.01 v35.69,56.01
N$15
  Top 0.254: C22.1 17.39,23.75 18.92,23.75 19.9,24.73 Y1.P$1 19.77,23.96 19.05,23.24 19.05,22.1 19.43,21.72 19.96,21.19 U7.43
N$16  (via drill 0.6)
  Top 0.254: U9.10 28.35,6.07 28.32,6.1 28.07,6.35 26.42,6.35 26.29,6.48 26.29,7.24 24.77,8.76 24.77,9.65 24.26,10.16 24.26,10.79 23.88,11.18 22.73,11.18 20.57,9.02 v20.57,8.76
  Bottom 0.254: U11.2 13.41,21.8 8.89,17.27 8.89,15.88 16,8.76 v20.57,8.76
N$17  (via drill 0.6)
  Top 0.254: U9.11 28.12,5.41 27.69,5.84 26.16,5.84 25.78,6.22 25.78,6.99 24.26,8.51 24.26,9.27 v23.24,10.29
  Bottom 0.254: U11.1 8.26,18.04 8.26,15.62 16.13,7.75 20.95,7.75 21.97,8.76 21.97,9.4 22.86,10.29 v23.24,10.29
N$18  (via drill 0.6)
  Top 0.254: U7.16 42.29,20.19 50.67,28.57 52.7,28.57 52.72,28.57 v52.77,28.52
  Bottom 0.254: U8.5 51.61,29.69 v52.77,28.52 | v52.77,28.52 52.84,28.45 | 52.84,28.45 C17.2 | v52.77,28.52 52.84,28.45
N$19  (via drill 0.6)
  Top 0.254: U9.12 33.4,4.83 33.15,4.57 27.56,4.57 v27.3,4.83
  Bottom 0.254: U11.8 17.91,16.8 17.91,15.62 18.54,14.99 18.54,13.97 15.62,11.05 15.62,10.67 16.51,9.78 19.43,9.78 21.72,12.06 23.75,12.06 24.77,11.05 24.77,7.75 27.3,5.21 v27.3,4.83
N$20  (via drill 0.6)
  Top 0.254: 52.32,30.24 v52.83,30.24 52.83,30.23 51.56,30.23 42.02,20.69 U7.17
  Bottom 0.254: U8.4 v52.83,30.24 | v52.83,30.24 53.09,30.24 | 53.09,30.24 55.23,30.24 55.24,30.23 C18.2 | v52.83,30.24 53.09,30.24
N$21  (via drill 0.6)
  Top 0.254: U7.18 41.86,21.19 v52.96,32.29
  Bottom 0.254: C19.2 53.31,32.29 | 53.31,32.29 v52.96,32.29 | v52.96,32.29 U8.16 | v52.96,32.29 53.31,32.29
N$22
  Top 0.254: 30.98,50.63 U3.1 30.99,50.67 30.35,51.31 28.23,51.31 R7.2
N$23  (via drill 0.6)
  Top 0.254: v25.91,4.83 26.8,3.94 33.4,3.94 33.81,4.34 U9.13
  Bottom 0.254: U11.7 16.51,16.96 16.51,16.26 18.03,14.73 18.03,14.22 14.99,11.18 14.99,10.54 16.26,9.27 19.81,9.27 22.1,11.56 23.24,11.56 24.26,10.54 24.26,7.49 25.91,5.84 v25.91,4.83
N$24
  Top 0.254: Q2.2 41.09,48.67 R10.1 41.87,51.56 38.61,51.56 38.35,51.56 37.08,50.29 35,50.29 arc90 U3.11
N$25
  Top 0.254: U4.P6 18,41.12 17.91,41.02 C9.1
N$26
  Top 0.254: C10.1 14.8,46.37 U4.P12
N$27
  Top 0.254: U4.P13 14.06,44.48 14.1,44.45 11.98,46.57 C10.2
N$28
  Top 0.254: U2.16 18.49,52.02 18.03,51.56 18.03,50.55 17.65,50.16 13.72,50.16 R6.1
N$29
  Top 0.254: R4.1 18.05,54.25 U2.12
N$30
  Top 0.254: U2.14 16.08,53.03 15.62,52.58 R3.1
N$31
  Top 0.406: U1.2 41.05,54.61 42.04,54.61 43.36,55.93 C2.2
N$32  (via drill 0.5)
  Top 0.254: U9.34 35.41,10.82 35.05,11.18 34.04,11.18 33.15,12.06 v32.89,12.06 | v44.45,9.02 44.96,9.02 45.59,9.65 46.23,9.65 v46.48,9.91
  Bottom 0.254: U11.3 14.79,21.46 16,21.46 19.81,17.65 19.81,13.72 20.45,13.08 24.26,13.08 26.67,10.67 33.02,10.67 33.53,10.16 35.31,10.16 37.47,8 40.89,8 41.91,9.02 v44.45,9.02 | v46.48,9.91 45.97,10.41 41.78,10.41 40.39,9.02 37.97,9.02 37.34,9.65 35.81,11.18 34.04,11.18 33.15,12.06 v32.89,12.06
N$33  (via drill 0.6)
  Top 0.406: U3.7 35.2,48.39 v36.2,48.39 | v33.91,52.45 33.95,52.49 R12.1 33.95,57.47 SL1.3
  Bottom 0.406: v36.2,48.39 33.91,50.67 v33.91,52.45
N$37  (via drill 0.5)
  Top 0.254: 36.2,10.16 36.2,10.29 | 36.2,10.29 U9.32 | U9.32 36.2,11.05 36.7,11.56 50.04,11.56 51.56,12.95 53.21,12.95 v53.59,13.34 | U9.32 36.2,10.29
  Bottom 0.254: U11.5 16.26,19.81 16.89,19.81 19.3,17.4 19.3,13.46 20.19,12.57 24,12.57 26.42,10.16 32.64,10.16 33.15,9.65 34.92,9.65 38.86,5.84 45.59,5.84 48.01,8.26 48.51,8.26 v53.59,13.34
N$39  (via drill 0.6)
  Top 0.254: C5.2 30.48,54.61 30.35,54.61 | U3.4 U3.3
  Top 0.305: v29.34,49.4 30.1,49.4 | 30.1,49.4 30.99,49.4 | U3.3 30.53,49.84 30.1,49.4
  Top 0.406: 20.71,51.3 U2.3 20.73,49.51 v20.83,49.4 20.22,50.01 U2.2 | SL1.2 30.35,58.5 30.35,54.61 v30.35,52.7
  Bottom 0.305: v30.35,52.7 29.34,51.69 v29.34,49.4
  Bottom 0.406: v20.83,49.4 v29.34,49.4
N$40  (via drill 0.6)
  Top 0.254: U2.1 18.92,50.52 v18.92,50.16 | SL1.1 27.84,52.3 v27.81,52.32
  Bottom 0.254: v18.92,50.16 25.65,50.16 v27.81,52.32
N$43  (via drill 0.5)
  Top 0.254: U9.33 35.79,11.2 34.92,12.06 v34.42,12.06
  Bottom 0.254: U11.CD2 24.66,25.25 23.24,26.67 22.35,26.67 21.46,25.78 21.46,23.24 21.97,22.73 21.97,19.05 21.97,15.37 22.23,15.11 25.4,15.11 27.81,12.7 28.32,12.7 29.59,13.97 32.51,13.97 v34.42,12.06
N$46  (via drill 0.5)
  Top 0.254: U9.27 41.17,8.48 v43.05,6.73 | v45.47,7.11 47.12,7.11 47.37,6.86 47.35,6.83 R15.2
  Bottom 0.254: v43.05,6.73 43.43,7.11 v45.47,7.11
N$48
  Top 0.254: U9.38 33.81,10.77 33.4,11.18 29.11,11.18 C23.1
  Top 0.406: C23.1 29.05,11.08
RF_LFN
  Top 0.254: U$1.20 17.74,37.68 19.3,39.24 20.84,39.24 U13.4
RF_LFP
  Top 0.254: U$1.19 16.61,36.93 16.89,37.21 17.91,37.21 19.3,38.61 20.83,38.61 U13.3
RF_WK  (via drill 0.5, 0.6)
  Top 0.254: U13.8 24.58,40.08 25.78,41.27 v27.56,41.27 | v35.94,35.18 36.2,35.18 38.1,33.27 38.1,30.73 36.58,29.21 v36.58,23.75 | v27.94,13.84 27.94,14.99 27.43,15.62 27.43,17.78 27.48,17.82 U7.1 | v36.58,19.18 36.58,18.29 37.72,17.14 43.05,17.14 43.81,17.91 46.35,17.91 46.61,18.16 v48.26,18.16
  Bottom 0.254: v27.56,41.27 33.66,35.18 34.8,35.18 v35.94,35.18 | v36.58,23.75 v36.58,19.18 | v27.94,13.84 27.94,15.88 29.34,17.27 40.39,17.27 42.55,17.27 43.43,18.16 47.12,18.16 | v48.26,18.16 47.12,18.16 | 47.12,18.16 46.99,18.16 47.12,18.16
RFWK_CS  (via drill 0.5, 0.6)
  Top 0.254: U13.11 24.69,37.9 26.67,39.88 v27.56,39.88 | v33.66,34.16 34.16,34.16 35.31,33.02 v36.58,31.75 | U7.5 29.48,16.5 32.51,13.46 35.05,13.46 35.94,12.57 39.12,12.57 49.53,12.57 v52.58,15.62 | v39.62,19.18 40.64,18.16 42.04,18.16 42.8,18.92 45.59,18.92 46.99,20.32 v47.37,20.32 | v38.99,31.75 38.99,30.86 37.21,29.08 37.21,27.56 37.47,27.3 38.48,27.3 39.5,26.29 40.89,26.29 41.4,25.78 v41.4,24.51
  Bottom 0.254: v27.56,39.88 28.19,39.88 32.89,35.18 33.66,34.42 v33.66,34.16 | v36.58,31.75 v38.99,31.75 | v41.4,24.51 41.4,23.62 39.62,21.84 v39.62,19.18 | v52.58,15.62 52.58,17.27 49.53,20.32 v47.37,20.32
SD_CD  (via drill 0.5, 0.6)
  Top 0.254: U7.26 32.48,26 32.51,26.04 32.89,26.42 v33.53,26.42 | v38.1,26.42 v38.1,23.75 | v38.1,19.18 38.1,18.92 39.24,17.78 39.37,17.65 42.42,17.65 43.18,18.41 45.97,18.41 46.99,19.43 v48.26,19.43 | v53.47,14.73 53.72,14.73 54.61,13.84 54.61,12.95 52.96,11.3 52.45,10.79 48.51,10.79 45.72,10.79 45.47,11.05 39.5,11.05 38.12,9.68 37.36,9.68 U9.30
  Bottom 0.254: v33.53,26.42 v38.1,26.42 | v38.1,23.75 v38.1,19.18 | v53.47,14.73 52.2,14.73 51.69,15.24 51.69,16 52.07,16.38 52.07,17.02 49.66,19.43 v48.26,19.43
SD_CS  (via drill 0.5)
  Top 0.254: U7.6 29.98,16.63 32.64,13.97 35.31,13.97 36.2,13.08 39.12,13.08 49.15,13.08 51.56,15.49 51.56,16.13 52.07,16.64 53.47,16.64 v53.98,16.13 | 34.19,4.55 v34.8,3.94 34.19,4.55 | 34.19,4.55 U9.14 34.19,4.55
  Bottom 0.254: v53.98,16.13 53.98,16.89 54.36,17.27 56.26,17.27 56.52,17.02 56.52,15.62 55.12,14.22 55.12,12.83 54.23,11.94 53.72,11.94 49.02,7.24 48.51,7.24 46.1,4.83 44.45,4.83 43.05,3.43 41.91,3.43 41.02,4.32 40.01,4.32 38.23,4.32 35.18,4.32 v34.8,3.94
SPI_CLK  (via drill 0.5, 0.6)
  Top 0.254: U13.12 25.44,37.25 v26.42,38.23 28.72,38.23 U6.2 | U$1.18 18.52,36.43 v19.81,37.72 | v17.78,5.08 17.78,14.86 v7.24,25.4 | U7.11 32.48,17.18 33.53,16.13 36.45,16.13 37.21,15.37 44.96,15.37 v45.34,15.75 | v42.42,4.45 43.31,5.21 43.94,5.84 43.94,7.24 43.94,8.26 42.8,9.4 41.53,9.4 40.77,10.03 v40.13,10.03 39.37,9.27 U9.29
  Bottom 0.254: v26.42,38.23 25.91,37.72 v19.81,37.72 19.56,37.72 17.27,35.43 v7.24,25.4 | v17.78,5.08 18.54,5.59 22.99,5.59 25.27,3.3 32,3.3 33.53,4.83 37.72,4.83 39.5,4.83 42.04,4.83 v42.42,4.45 | 45.34,15.37 v45.34,15.75 45.34,15.24 v40.13,10.03
SPI_MISO  (via drill 0.6)
  Top 0.254: 23.11,36.32 U13.14 23.06,35.62 23.5,35.18 | U7.25 33.48,25.53 34.16,25.53 34.54,25.91 34.54,29.84 v33.66,30.73 | 23.5,35.18 v26.97,35.18 U6.4 | v23.24,8.76 25.27,6.73 25.27,5.71 25.02,5.33 25.02,3.68 25.4,3.3 29.59,3.3 29.84,3.05 35.18,3.05 35.69,3.56 35.69,4.45 35.43,4.7 35.43,5.38 U9.17 | U$1.16 20.7,35.43 21.34,34.8 21.34,33.4 21.72,33.02 23.11,33.02 23.5,33.4 23.5,35.18
  Bottom 0.254: v33.66,30.73 33.27,31.11 29.46,31.11 26.97,33.61 v26.97,35.18 26.72,35.43 18.03,35.43 8.13,25.52 8.13,22.99 5.71,20.57 5.71,20.19 7.62,18.41 7.62,15.49 15.88,7.24 21.72,7.24 v23.24,8.76
SPI_MOSI  (via drill 0.5, 0.6)
  Top 0.254: U7.24 35.05,25.43 35.05,29.34 v35.05,31.62 | U13.13 23.71,35.98 24,35.69 25.91,35.69 26.29,36.07 26.29,36.2 | 26.29,36.2 v26.29,36.45 | v26.29,36.45 26.29,36.7 27.23,37.65 U6.3 | v26.29,36.45 26.29,36.2 | U$1.17 17.13,35.93 19.42,35.93 v19.81,36.32 | U9.31 36.8,10.54 v37.72,10.54 | v49.91,15.24 49.91,15.62 51.94,17.65 v53.47,17.65 | v38.99,29.34 v41.4,27.05 | v44.83,20.83 46.1,22.1 50.55,22.1 51.05,21.59 v53.47,21.59
  Bottom 0.254: v19.81,36.32 26.16,36.32 v26.29,36.45 26.92,36.45 27.94,35.43 27.94,33.78 27.94,33.66 29.97,31.62 v35.05,31.62 37.34,29.34 v38.99,29.34 | v37.72,10.54 43.94,16.76 45.85,16.76 47.37,15.24 v49.91,15.24 | v41.4,27.05 41.91,26.54 43.43,26.54 44.83,25.15 v44.83,20.83 | v53.47,21.59 v53.47,17.65
SU_BERR  (via drill 0.6)
  Top 0.254: v22.99,24.13 23.37,23.75 24.51,23.75 25.57,22.69 U7.40 | v26.67,15.11 26.67,12.95 25.27,11.3 25.27,10.67 26.16,9.78 28.07,9.78 30.23,7.62 32.28,7.62 U9.6
  Bottom 0.254: v22.99,24.13 22.99,19.68 22.99,16.76 23.24,16.51 24.77,16.51 25.27,17.02 26.29,17.02 26.67,16.64 v26.67,15.11
SU_BUSY  (via drill 0.6)
  Top 0.254: U9.7 32.31,7.24 29.84,7.24 27.81,9.27 25.91,9.27 24.77,10.41 24.77,11.68 25.65,12.95 v25.65,16 | v22.99,25.65 24.26,24.38 24.64,24.38 25.91,23.11 26.67,23.11 26.64,23.11 U7.39
  Bottom 0.254: v22.99,25.65 22.73,25.65 22.1,25.02 22.1,23.5 22.48,23.11 22.48,19.3 22.48,16.38 22.86,16 v25.65,16
SU_FREF
  Top 0.254: U7.12 32.98,17.32 33.66,16.64 36.7,16.64 36.83,16.64 37.34,16.13 43.81,16.13 44.45,16.76 46.23,16.76 46.74,16.26 47.75,16.26 52.07,20.57 55.24,20.57 56.52,19.3 56.52,15.62 55.12,14.22 55.12,12.83 55.12,12.57 52.83,10.29 48.64,10.29 46.74,8.38 45.21,8.38 44.58,7.75 44.58,5.33 | 42.8,3.56 44.58,5.33 | 42.8,3.56 44.58,5.33 | U9.25 37.34,7.75 41.02,7.75 41.15,7.75 41.91,6.99 41.91,5.46 41.53,5.08 41.53,3.81 41.78,3.56 42.8,3.56
SU_MODE  (via drill 0.6)
  Top 0.254: U9.8 29.44,6.88 28.07,8.26 v26.67,8.26 | U7.9 31.48,16.78 33.27,14.99 36.07,14.99 36.96,14.1 47.12,14.1 51.56,18.54 55.24,18.54 55.63,18.16 v55.63,16.26
  Bottom 0.254: v26.67,8.26 27.81,8.26 30.73,5.33 45.85,5.33 48.26,7.75 48.77,7.75 53.47,12.45 53.98,12.45 54.61,13.08 54.61,15.24 v55.63,16.26
UARTRX  (via drill 0.6)
  Top 0.254: U7.21 33.86,22.73 38.61,22.73 39.12,23.24 39.12,24.38 39.88,25.15 v40.13,25.4 | v18.67,33.53 18.27,33.93 U$1.13
  Bottom 0.254: v40.13,25.4 33.02,25.4 31.37,23.75 27.94,23.75 23.75,27.94 20.07,31.62 18.67,33.02 v18.67,33.53
UARTTX  (via drill 0.6)
  Top 0.254: U7.20 33.85,22.23 39.24,22.23 40.13,23.11 v40.13,23.75 | v17.27,33.02 16.86,33.43 U$1.12
  Bottom 0.254: v40.13,23.75 38.99,24.89 33.27,24.89 31.62,23.24 28.57,23.24 28.19,23.24 27.69,23.24 23.37,27.56 19.68,31.24 18.16,32.77 17.53,32.77 v17.27,33.02
V2.5  (via drill 0.6)
  Top 0.254: 27.39,48.93 27.43,48.9 27.52,48.9 R7.1 | R7.1 28.28,48.93 28.7,48.51 29.72,48.51 | 29.72,48.51 30.23,49.02 U3.5 | R9.2 v38.99,47.5 Q1.1 | v30.73,47.5 29.72,48.51 | R10.2 v42.93,47.5 Q2.1 | U3.2 30.53,50.24 29.97,50.8 28.83,50.8 28.57,50.55 28.57,49.95 R7.1
  Top 0.305: 27.43,48.9 27.43,48.98 C6.2
  Bottom 0.254: v30.73,47.5 v38.99,47.5 v42.93,47.5
VBUS  (via drill 0.6, 0.61)
  Top 0.254: v5.08,40.64 5.08,38.1 6.35,36.83 v6.35,27.94 | C4.2 15.62,54.36
  Top 0.406: U2.13 16.94,53.54 16.09,54.4 C4.2 | v13.59,54.36 15.62,54.36
  Bottom 0.254: 12.7,53.47 12.7,48.26 v5.08,40.64 | v6.35,27.94 6.35,29.21 JP1.VBUS
  Bottom 0.406: v13.59,54.36 12.7,53.47 11.81,52.58 11.81,50.55 6.35,45.09 6.35,39.24 5.97,38.86 5.71,38.61 5.71,37.47 5.71,37.34 6.1,36.96 6.1,36.07 6.86,35.31 6.86,34.92 6.86,34.16 8.64,32.64 8.64,30.73 7.21,29.31 JP1.VBUS
VCC  (via drill 0.5, 0.5 layers 1-2, 0.6, 0.6 layers 1-2, 0.7)
  Top 0.254: C7.1 C8.1 | R14.2 40.09,38.99 40.01,38.99 40.13,38.86 v40.13,37.59 | R13.2 36.07,38.93 v36.07,37.59 | 38.99,6.22 v38.99,3.43 | U9.28 42.06,8.87 v42.93,8 | v40.89,6.73 40.26,6.1 v40.26,3.43 | U6.1 28.83,38.99 | U$1.1 10.92,37.72
  Top 0.305: U9.39 U9.40 33.02,10.31 33.02,10.29 | U9.23 38.46,6.88 38.99,6.22 | U13.15 22.41,34.22 v22.35,34.16 | U9.9 28.83,6.48 28.07,7.24 v27.56,7.24 | U9.5 31.29,8.08 v30.99,8.38
  Top 0.406: U4.P14 11.48,43.48 v11.43,43.43 | C8.1 8.68,46.19 v11.43,43.43 | U4.P1 12.38,42.48 v11.43,43.43 | U1.1 41.18,53.82 C3.2 43.31,53.78 43.31,52.58 44.2,51.69 v44.96,51.69 | C14.2 31.15,43.66 C13.2 29.97,42.48 v29.97,41.78 | C24.2 21.72,43.77 v21.72,41.78 21.72,40.08 U13.5 | v48.26,34.92 48.26,36.96 50.42,39.12 v52.13,39.12 | C26.2 11.96,17.02 C20.1 11.81,17.02 v10.92,17.91 10.16,17.14 v5.33,17.14 5.33,18.8 v8.76,22.23 | U$1.1 10.88,42.88 v11.43,43.43 | U7.37 25.91,24.92 v25.91,27.94 22.86,27.94 21.72,26.8 21.72,23.58 C11.1 | 28.83,38.99 U6.16 29.97,40.21 v29.97,41.78 | U6.15 30.66,41.09 v29.97,41.78 | v9.14,41.02 6.86,43.31 v4.7,43.31 | v25.91,30.61 16.26,30.61 13.97,28.32 13.97,27.43 v10.41,23.88 17.02,17.27 20.32,17.27 C12.2 20.32,17.4 20.45,17.27 | v12.57,39.37 10.92,37.72 | 26.64,18.26 U7.48 26.64,17.75 v26.16,17.27 | 33.02,10.29 32.89,10.41 31.37,10.41 v30.86,10.16
  Bottom 0.254: v40.13,37.59 40.13,37.47 | v36.07,37.59 36.07,37.47 | 11.43,43.18 v11.43,43.43 | v40.89,6.73 42.16,8 v42.93,8
  Bottom 0.406: v11.43,43.43 11.43,43.56 | v44.96,51.69 52.13,44.52 v52.13,39.12 U5.1 | v21.72,41.78 21.72,41.66 | U5.4 49.76,34.92 v48.26,34.92 | U11.4 12.79,17.91 v10.92,17.91 | v25.91,27.94 25.91,27.81 | v5.33,17.14 5.08,16.13 4.95,16.13 | v29.97,41.78 30.23,41.78 | v8.76,22.23 v10.41,23.88
  pour VCC (isolate 0.305): 31,0 arc-90 0,31 arc-90 31,62 44,62 53,53 41,41 41,19.35 62.02,19.16 44,0
XB_CS  (via drill 0.5, 0.6)
  Top 0.254: U$1.9 9.55,33.43 8.89,32.77 8.89,26.67 v10.16,25.4 | U7.7 30.48,16.77 32.77,14.48 35.69,14.48 36.58,13.59 48.01,13.59 v48.51,14.1
  Bottom 0.254: v48.51,14.1 48.51,10.41 46.99,8.89 46.23,8.89 45.21,9.91 43.81,9.91 43.43,9.53 41.66,9.53 40.64,8.51 37.72,8.51 35.56,10.67 35.43,10.67 33.78,10.67 33.27,11.18 26.92,11.18 24.51,13.59 20.7,13.59 20.32,13.97 20.32,17.91 12.83,25.4 v10.16,25.4
XB_DR
  Top 0.254: U7.30 30.48,26.05 30.48,27.3 30.99,27.81 30.99,29.08 30.99,31.24 30.35,31.88 29.59,31.88 28.7,32.77 27.81,33.66 25.4,33.66 23.75,32 21.08,32 20.19,32.89 20.19,33.78 19.81,34.16 19.56,34.42 15.24,34.42 15.25,34.43 U$1.14
XB_SLEEP  (via drill 0.6)
  Top 0.254: U$1.10 9.4,31.2 9.4,28.45 v11.18,26.67 | U7.2 27.98,15.71 30.35,13.34 v30.35,12.45
  Bottom 0.254: v30.35,12.45 29.59,11.68 27.18,11.68 24.77,14.1 21.21,14.1 20.83,14.48 20.83,18.16 12.32,26.67 v11.18,26.67

### Text on the board
bPlace: T | + | - | 3.7V Bat | USB | SD